# Altium schematic sheet GateDriver.SchDoc
size A4; SheetNumber: 4; SheetTotal: 4
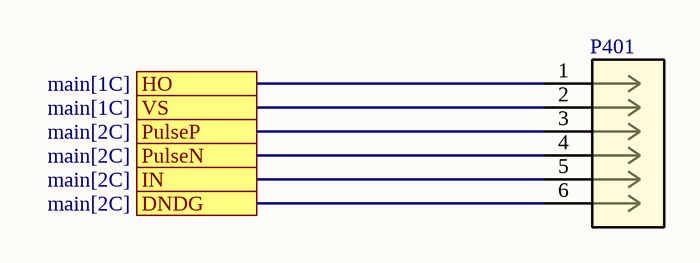
[diagram p0: GateDriver.SchDoc]

## Parts
P401  EBC06DCWN  [CONN12_EBC06DCWN_SUL]  (value not drawn)

## Ports
DNDG (see main[2C]), HO (see main[1C]), IN (see main[2C]), PulseN (see main[2C]), PulseP (see main[2C]), VS (see main[1C])

## Nets
DNDG: P401.6 ; port DNDG
HO: P401.1 ; port HO
IN: P401.5 ; port IN
PulseN: P401.4 ; port PulseN
PulseP: P401.3 ; port PulseP
VS: P401.2 ; port VS

## Library data of the parts
P401 = EBC06DCWN: 12 Position Female Connector Non Specified - Dual Edge Gold 0.100" (2.54mm) Blue / https://www.digikey.co.nz/en/products/detail/sullins-connector-solutions/EBC06DCWN/927245; ComponentLink1Description: New link; ComponentLink1URL: https://www.digikey.co.nz/en/products/detail/sullins-connector-solutions/EBC06DCWN/927245